# EAGLE design newday_v0001 (EAGLE 7.2.0)

## Sheet 1 of 2
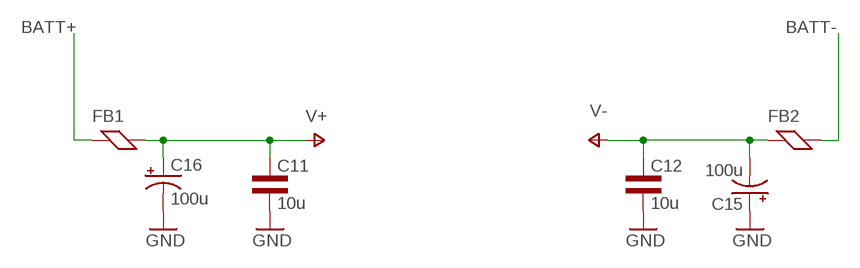
[diagram p0: schematic, sheet 1]

### Parts
C11  10u  CAP1210L3  [1210L3]
C12  10u  CAP1210L3  [1210L3]
C15  100u  CPOL-USE5-10.5  [E5-10,5]
C16  100u  CPOL-USE5-10.5  [E5-10,5]
FB1  FERRITE0805L3  [0805L3]
FB2  FERRITE0805L3  [0805L3]

### Nets
BATT+: FB1.1
BATT-: FB2.2
GND: C11.P$2 C12.P$2 C15.+ C16.- ; also sheet 2
V+: C11.P$1 C16.+ FB1.2 ; also sheet 2
V-: C12.P$1 C15.- FB2.1 ; also sheet 2

## Sheet 2 of 2
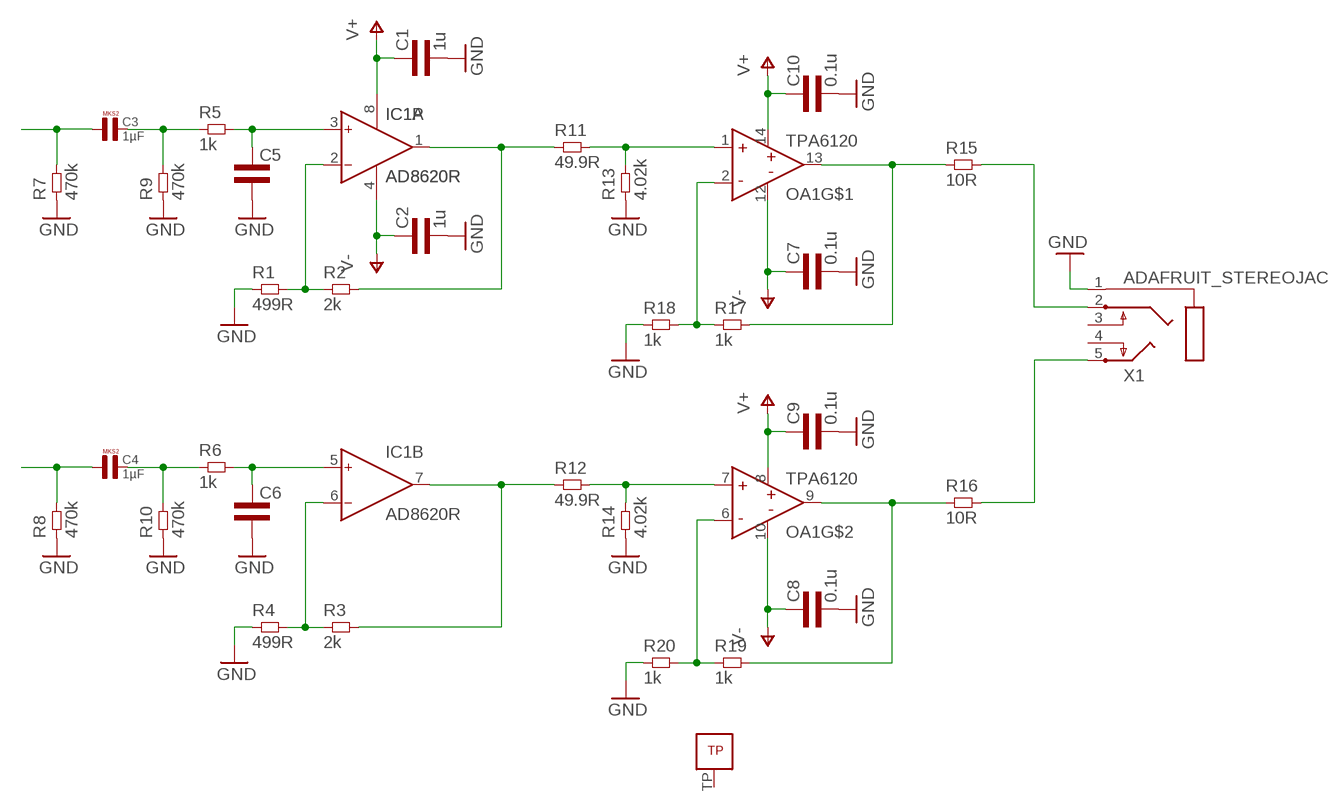
[diagram p1: schematic, sheet 2]

### Parts
C1  1u  CAP0805L3  [0805L3]
C2  1u  CAP0805L3  [0805L3]
C3  1µF  [R5B3K5]
C4  1µF  [R5B3K5]
C5  CAP0603L3  [0603L3]
C6  CAP0603L3  [0603L3]
C7  0.1u  CAP0603L3  [0603L3]
C8  0.1u  CAP0603L3  [0603L3]
C9  0.1u  CAP0805L3  [0805L3]
C10  0.1u  CAP0805L3  [0805L3]
IC1  AD8620R  [SO8]
OA1  TPA6120QFN  [S-PVQFN-N14]
R1  499R  RES0603L3  [0603L3]
R2  2k  RES0603L3  [0603L3]
R3  2k  RES0603L3  [0603L3]
R4  499R  RES0603L3  [0603L3]
R5  1k  RES0603L3  [0603L3]
R6  1k  RES0603L3  [0603L3]
R7  470k  RES0603L3  [0603L3]
R8  470k  RES0603L3  [0603L3]
R9  470k  RES0603L3  [0603L3]
R10  470k  RES0603L3  [0603L3]
R11  49.9R  RES0805L3  [0805L3]
R12  49.9R  RES0805L3  [0805L3]
R13  4.02k  RES0805L3  [0805L3]
R14  4.02k  RES0805L3  [0805L3]
R15  10R  RES1210L3  [1210L3]
R16  10R  RES1210L3  [1210L3]
R17  1k  RES0603L3  [0603L3]
R18  1k  RES0603L3  [0603L3]
R19  1k  RES0603L3  [0603L3]
R20  1k  RES0603L3  [0603L3]
X1  ADAFRUIT_STEREOJACK  [ADAFRUIT_STX3100]

### Nets
GND: C1.2 C2.2 C5.P$2 C6.P$2 C7.P$2 C8.P$2 C9.2 C10.2 R1.P$1 R4.P$1 R7.P$1 R8.P$1 R9.P$1 R10.P$1 R13.1 R14.1 R18.P$1 R20.P$1 X1.1 ; also sheet 1
LEFT_BUF_FB: OA1.2(IN-) R17.P$1 R18.P$2
LEFT_BUF_IN: OA1.1(IN+) R11.2 R13.2
LEFT_BUF_OUT: OA1.13(OUT) R15.P$1 R17.P$2
LEFT_CAP_OUT: C3.2 R5.P$1 R9.P$2
LEFT_FILTER_OUT: C5.P$1 IC1.3(A:IN+) R5.P$2
LEFT_GAIN_FB: IC1.2(A:IN-) R1.P$2 R2.P$1
LEFT_GAIN_OUT: IC1.1(A:OUT) R2.P$2 R11.1
LEFT_HP_OUT: R15.P$2 X1.2
LEFT_IN: C3.1 R7.P$2
RIGHT_BUF_FB: OA1.6(IN-) R19.P$1 R20.P$2
RIGHT_BUF_IN: OA1.7(IN+) R12.2 R14.2
RIGHT_BUF_OUT: OA1.9(OUT) R16.P$1 R19.P$2
RIGHT_CAP_OUT: C4.2 R6.P$1 R10.P$2
RIGHT_FILTER_OUT: C6.P$1 IC1.5(B:IN+) R6.P$2
RIGHT_GAIN_FB: IC1.6(B:IN-) R3.P$1 R4.P$2
RIGHT_GAIN_OUT: IC1.7(B:OUT) R3.P$2 R12.1
RIGHT_HP_OUT: R16.P$2 X1.5
RIGHT_IN: C4.1 R8.P$2
V+: C1.1 C9.1 C10.1 IC1.8(P:V+) OA1.8(V+) OA1.14(V+) ; also sheet 1
V-: C2.1 C7.P$1 C8.P$1 IC1.4(P:V-) OA1.10(V-) OA1.12(V-) ; also sheet 1
Unconnected: OA1.TP X1.3 X1.4

## Library data of the parts
C1 C2 C5-C12 = common:CAP
C3 C4 = Capacitor-Wima-MKS2-16v:1µF
C15 C16 = rcl:CPOL-US: POLARIZED CAPACITOR, American symbol
FB1 FB2 = common:FERRITE
IC1 = analog-devices:AD8620: Precision, Very Low Noise, Low Input Bias Current, Wide Bandwidth JFET Operational Amplifiers Source: http://www.analog.com/static/imported-files/data_sheets/AD8610_8620.pdf; MF: ALTERA CORPORATION; MPN: AD8620ARZ; OC_FARNELL: 9994386; OC_NEWARK: 59K6972
OA1 = common:TPA6120
R1-R20 = common:RES
X1 = my_dac_amp:ADAFRUIT_STEREOJACK: MIC/HEADPHONE JACK Stereo jack with two switches. Kycon STX3100, CUI SJ1-3555NG and/or 4UCon 05544

## Board
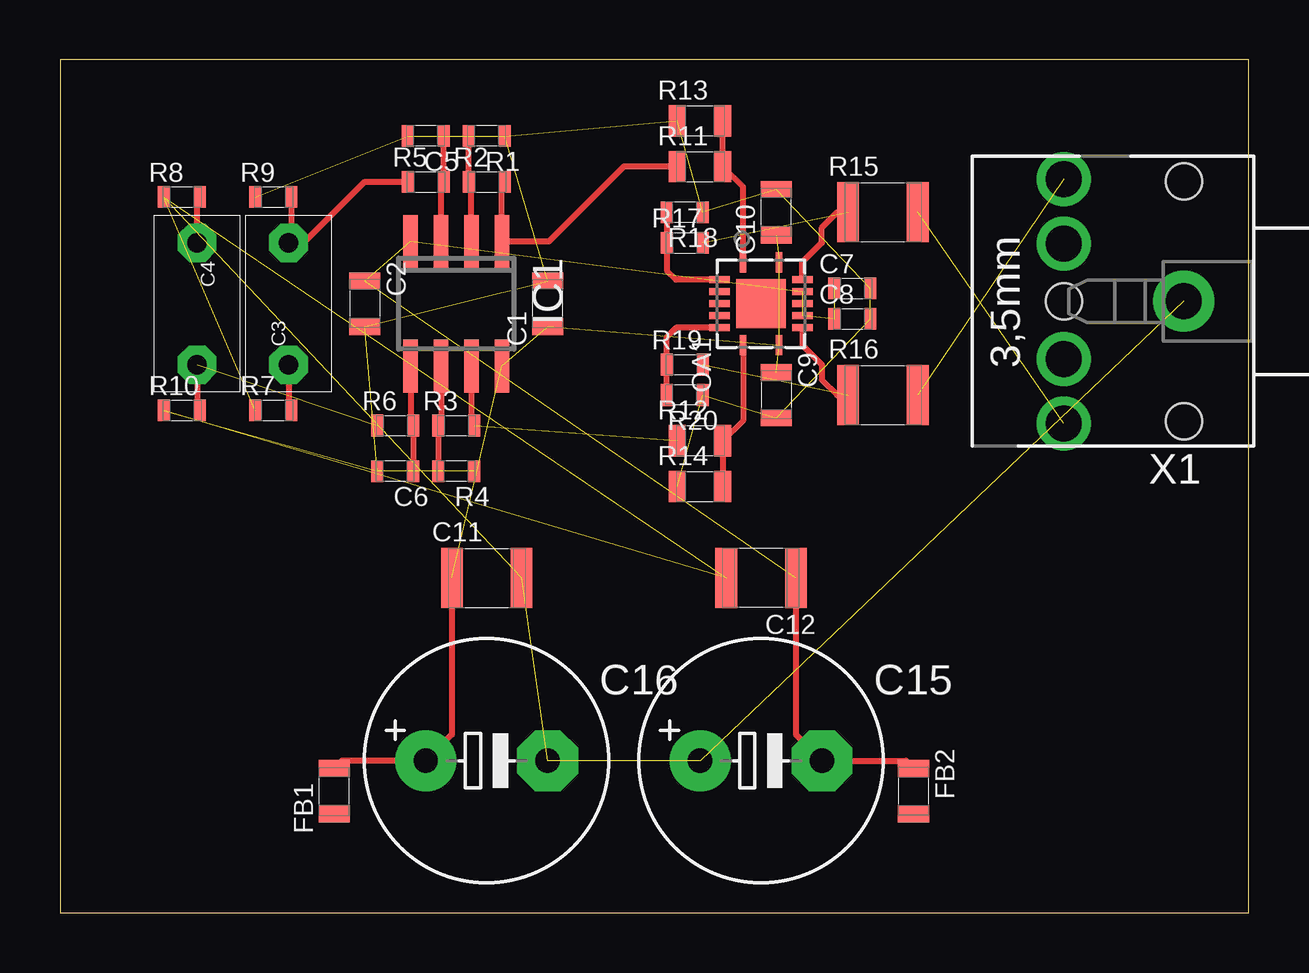
[diagram p2: board, top side]

Size 49.53 x 35.56 mm. Coordinates in mm from the lower left corner, seen from the top.
Outline: 0,0 49.53,0 49.53,35.56 0,35.56 0,0
Copper layers (1*16): Top 0.035mm / dielectric 1.5mm / Bottom 0.035mm
Design rules "default": minimum track width 10mil, minimum drill 24mil, track to track 8mil, track to pad 8mil, pad to pad 8mil, via to via 8mil, smd to smd 8mil, copper to edge 40mil, drill to drill 8mil, minimum pad ring 10mil, minimum via ring 8mil, stop-mask expansion 4mil, vias tented up to drill 0mil, thermal gap 10mil

### Footprints (pad centres in the part's own frame; a part is rotated, then mirrored left to right if it is on the bottom)
0805L3 = smd 0.7 x 1.3: 1 -0.95,0; 2 0.95,0
R5B3K5 = drill 0.813 pad 1.6 octagon: 1 -2.54,0; 2 2.54,0
0603L3 = smd 0.5 x 0.9: P$1 -0.75,0; P$2 0.75,0
1210L3 = smd 0.9 x 2.5: P$1 -1.45,0; P$2 1.45,0
E5-10,5 = drill 1.016 pad 2.54: + -2.54,0 | drill 1.016 pad 2.54 octagon: - 2.54,0
SO8 = smd 0.6 x 2.2: 1 -1.905,-2.6; 2 -0.635,-2.6; 3 0.635,-2.6; 4 1.905,-2.6; 5 1.905,2.6; 6 0.635,2.6; 7 -0.635,2.6; 8 -1.905,2.6
S-PVQFN-N14 = smd 0.85 x 0.28: 1 -1.725,-0.75; 7 1.725,-0.75; 8 1.725,0.75; 14 -1.725,0.75 | smd 0.28 x 0.85: 2 -1,-1.725; 3 -0.5,-1.725; 4 0,-1.725; 5 0.5,-1.725; 6 1,-1.725; 9 1,1.725; 10 0.5,1.725; 11 0,1.725; 12 -0.5,1.725; 13 -1,1.725 | smd 2.05 x 2.05: TP 0,0
ADAFRUIT_STX3100 = drill 1.5 pad 2.54: 1 2.7,-0.1 | drill 1.5: 2 7.7,5; 3 7.7,2.3; 4 7.7,-2.5; 5 7.7,-5.2 | hole 1.5: 2.7,4.9; 2.7,-5.1; 7.7,-0.1

### Placement (x,y rotation side)
C1  20.32,25.4 90 top
C2  12.7,25.4 270 top
C3  9.53,25.4 90 top
C4  5.72,25.4 270 top
C5  15.24,32.38 180 top
C6  13.97,18.41 180 top
C7  33.02,26.03 0 top
C8  33.02,24.77 0 top
C9  29.85,21.59 270 top
C10  29.85,29.21 90 top
C11  17.78,13.97 0 top
C12  29.21,13.97 180 top
C15  29.21,6.35 0 top
C16  17.78,6.35 0 top
FB1  11.43,5.08 90 top
FB2  35.56,5.08 270 top
IC1  16.51,25.4 180 top
OA1  29.21,25.4 270 top
R1  17.78,32.38 180 top
R2  17.78,30.48 0 top
R3  16.51,20.32 0 top
R4  16.51,18.41 180 top
R5  15.24,30.48 0 top
R6  13.97,20.32 0 top
R7  8.89,20.95 0 top
R8  5.08,29.84 0 top
R9  8.89,29.84 0 top
R10  5.08,20.95 0 top
R11  26.67,31.11 0 top
R12  26.67,19.68 0 top
R13  26.67,33.02 0 top
R14  26.67,17.78 0 top
R15  34.29,29.21 0 top
R16  34.29,21.59 0 top
R17  26.04,27.94 0 top
R18  26.04,29.21 180 top
R19  26.04,22.86 0 top
R20  26.04,21.59 180 top
X1  49.53,25.4 180 top

### Tracks (layer width: path | path; a pad name or v marks a point on that pad's centre or on a via)
GND  (22 unrouted)
LEFT_BUF_FB
  Top 0.254: OA1.2 25.67,26.4 25.29,26.78 R17.P$1 R18.P$2
LEFT_BUF_IN
  Top 0.254: OA1.1 28.46,30.27 R11.2 R13.2
LEFT_BUF_OUT  (1 unrouted)
  Top 0.254: OA1.13 30.93,27.12 31.75,27.94 31.75,28.57 32.39,29.21 R15.P$1
LEFT_CAP_OUT
  Top 0.254: R5.P$1 12.7,30.48 10.16,27.94 C3.2 9.64,28.05 R9.P$2
LEFT_FILTER_OUT
  Top 0.254: IC1.3 15.88,30.36 R5.P$2 C5.P$1
LEFT_GAIN_FB
  Top 0.254: IC1.2 17.14,30.36 R2.P$1 R1.P$2
LEFT_GAIN_OUT
  Top 0.254: R11.1 23.5,31.11 20.38,28 IC1.1 18.42,30.36 R2.P$2
LEFT_HP_OUT  (1 unrouted)
LEFT_IN
  Top 0.254: C3.1 9.53,21.07 R7.P$2
RIGHT_BUF_FB
  Top 0.254: OA1.6 25.67,24.4 25.29,24.02 R19.P$1 R20.P$2
RIGHT_BUF_IN
  Top 0.254: OA1.7 28.46,20.52 R12.2 R14.2
RIGHT_BUF_OUT  (1 unrouted)
  Top 0.254: OA1.9 30.93,23.67 31.75,22.86 31.75,22.23 32.39,21.59 R16.P$1
RIGHT_CAP_OUT  (1 unrouted)
  Top 0.254: C4.2 5.72,21.07 R10.P$2
RIGHT_FILTER_OUT
  Top 0.254: IC1.5 14.61,20.43 R6.P$2 C6.P$1
RIGHT_GAIN_FB
  Top 0.254: IC1.6 15.88,20.43 R3.P$1 R4.P$2
RIGHT_GAIN_OUT  (1 unrouted)
  Top 0.254: IC1.7 17.14,20.43 R3.P$2
RIGHT_HP_OUT  (1 unrouted)
RIGHT_IN
  Top 0.254: C4.1 5.72,29.73 R8.P$2
V+  (6 unrouted)
  Top 0.254: FB1.2 11.75,6.35 C16.+ 16.33,7.44 C11.P$1
V-  (6 unrouted)
  Top 0.254: FB2.1 35.24,6.35 C15.- 30.66,7.44 C12.P$1